# Altium project PCB_Soldeerstation.PrjPcb
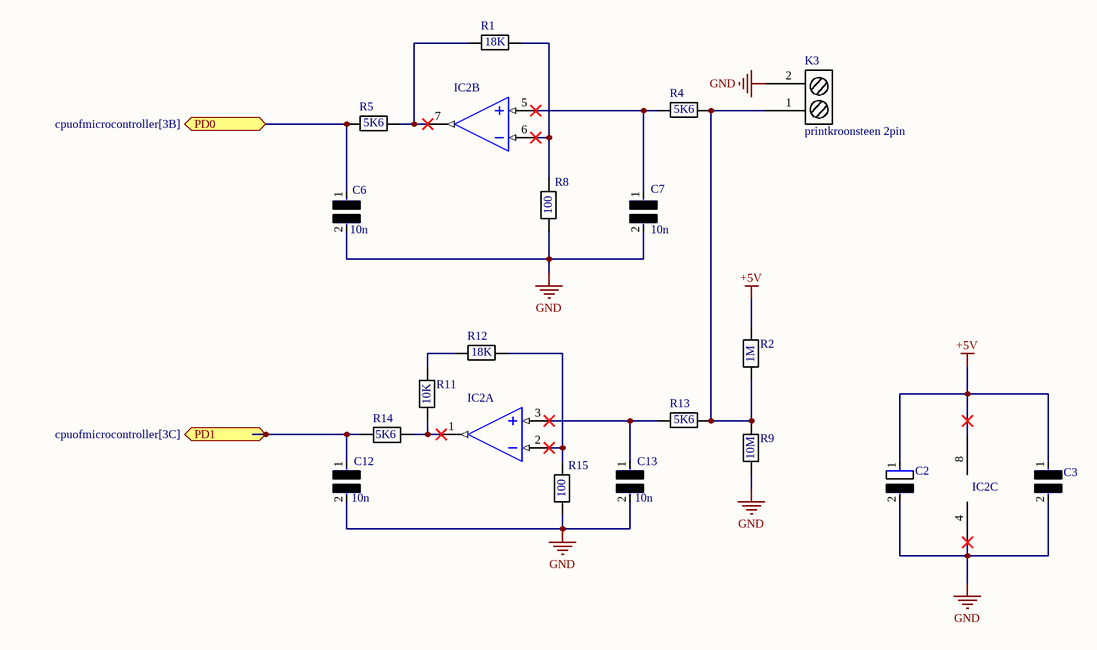
[diagram p0: soldeerboutaansturing.SchDoc]
5 sheets, 76 parts. Net scope: flat (ports and power ports of the same name join across sheets).
Board files: JVersiePCBSoldeerstation.PcbDoc, PCBbeeldscherm.PcbDoc
Sheets:
  soldeerboutaansturing.SchDoc
  thermokoppel.SchDoc
  display.SchDoc
  cpuofmicrocontroller.SchDoc
  voeding.SchDoc

## Sheet soldeerboutaansturing.SchDoc
size A4; SheetNumber: 1; SheetTotal: 5

### Parts
C2  (no value)  [RESC2013X50X30LL20T20]
C3  (no value)  [RESC2013X50X30LL20T20]
C6  10n  [RESC2013X50X30LL20T20]
C7  10n  [RESC2013X50X30LL20T20]
C12  10n  [RESC2013X50X30LL20T20]
C13  10n  [RESC2013X50X30LL20T20]
IC2  OPAMP  [DIP781W56P254L950H533Q8N]  (value not drawn)  (parts A,B,C of 3)
K3  printkroonsteen 2pin  [printkroonsteen 2pin]
R1  18K  [RESC2013X50X30LL20T20]
R2  1M  [RESC2013X50X30LL20T20]
R4  5K6  [RESC2013X50X30LL20T20]
R5  5K6  [RESC2013X50X30LL20T20]
R8  100  [RESC2013X50X30LL20T20]
R9  10M  [RESC2013X50X30LL20T20]
R11  10K  [RESC2013X50X30LL20T20]
R12  18K  [RESC2013X50X30LL20T20]
R13  5K6  [RESC2013X50X30LL20T20]
R14  5K6  [RESC2013X50X30LL20T20]
R15  100  [RESC2013X50X30LL20T20]

### Ports
PD0 (bidir, see cpuofmicrocontroller[3B]), PD1 (bidir, see cpuofmicrocontroller[3C])

### Nets
+5V: C2.1 C3.1 IC2.8 R2.2
GND: C2.2 C3.2 C6.2 C7.2 C12.2 C13.2 IC2.4 K3.2 R8.1 R9.1 R15.1
NetC6_1: C6.1 R5.1 ; port PD0
NetC7_1: C7.1 IC2.5(VINB+) R4.1
NetC12_1: C12.1 R14.2 ; port PD1
NetC13_1: C13.1 IC2.3(VINA+) R13.1
NetIC2_1: IC2.1(VOUTA) R11.1 R14.1
NetIC2_2: IC2.2(VINA-) R12.2 R15.2
NetIC2_6: IC2.6(VINB-) R1.2 R8.2
NetIC2_7: IC2.7(VOUTB) R1.1 R5.2
NetK3_1: K3.1 R2.1 R4.2 R9.2 R13.2
NetR11_2: R11.2 R12.1

### Library data of the parts
C2 = Elektrolytische Capacitor: CAP CER 0.1UF 10V X5R 0402; Manufacturer: Kemet; Manufacturer Part Number: C0402C104K8PACTU; Material: Ceramic; Capacitance: 0.10 μF; Temperature Coefficient: 15%; Tolerance: 0.1; Value: 0.10 μF; Package: C0402-BB; Temperature: -55°C to +125°C; ComponentLink2Description: Datasheet; Temperature Characteristic: X5R; Device Class L1: Passive Components; Height: 0.55mm; Lead Free: Yes; ComponentLink2URL: https://content.kemet.com/datasheets/KEM_C1002_X7R_SMD.pdf; Device Class L2: Capacitors; Temperature Range Low: -55°C; Temperature Range High: +125°C; RoHS: TRUE; Octopart: https://octopart.com/c0402c104k8pactu-kemet-140039; Automotive: No; Mouser Description: Capacitor 100 nF 10 VDC 0402 | KEMET C0402C104K8PACTU (Capacitor 100 nF 10 VDC 0402 Ceramic Capacitors).; Category: Cap; Voltage Rating: 10 V; Digikey Description: CAP CER 0.1UF 10V X5R 0402; Ipc Land Pattern Name: CAPC10050X50; Device Class L3: Ceramic Capacitors
C3 = Ceramische Capacitor
C6 C7 C12 C13 = capacitor2
IC2 = OPAMP: CMP-0187-00133-3; Slew Rate: 0.6V/µs; Supply Current: 100uA; Power Supply Rejection Ratio (PSRR): 86dB; Input Offset Voltage (Vos): 4.5mV; Input Bias Current: 1pA; Amplifier Type: GENERAL PURPOSE; Unity Gain Bandwidth Product: 1MHz; Number of Circuits: 2; Output Current: 23mA; Operating Supply Voltage: 5.5V; Min Supply Voltage: 1.8V; Common Mode Rejection Ratio: 60dB; Voltage Gain: 112dB; Max Supply Voltage: 6V; Package Quantity: 60; REACH SVHC: No SVHC; Min Operating Temperature: -40°C; Max Operating Temperature: 125°C; Mount: Through Hole; Nominal Supply Current: 100uA; Height: 3.3mm; Length: 9.27mm; Slew Rate-Nom: 0.6V/µs; Packaging: Rail/Tube; Output Current per Channel: 23mA; Number of Amplifiers: 2; RoHS Compliant: Yes; Radiation Hardening: No; Bandwidth: 1MHz; Lead Free: Lead Free; Width: 6.35mm; Number of Channels: 2; Gain Bandwidth Product: 1MHz; Technology: CMOS; Operating Supply Current: 100uA; Number of Elements: 2; Number of Pins: 8; Input Offset Voltage-Max: 4.5mV; Case/Package: PDIP
R1 R2 R4 R5 R8 R9 R11-R15 = weerstand: Manufacturer: Vishay Dale; Part Number: CRCW08050000Z0EA

## Sheet thermokoppel.SchDoc
size A4; SheetNumber: 2; SheetTotal: 5
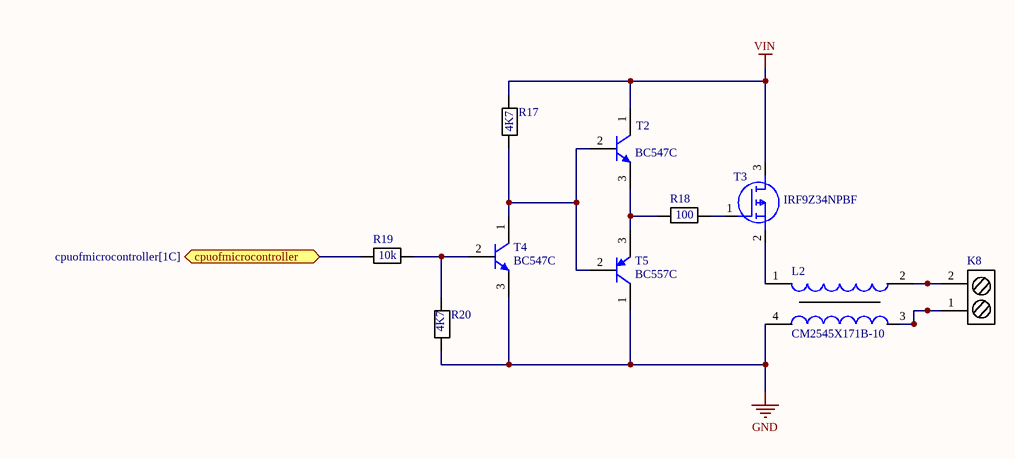
[diagram p1: thermokoppel.SchDoc]

### Parts
K8  (no value)  [printkroonsteen 2pin]
L2  CM2545X171B-10  [CM2545X171B10]
R17  4K7  [RESC2013X50X30LL20T20]
R18  100  [RESC2013X50X30LL20T20]
R19  10k  [RESC2013X50X30LL20T20]
R20  4K7  [RESC2013X50X30LL20T20]
T2  BC547C  [ONSC-TO-92-3-29-11]
T3  IRF9Z34NPBF  [TO254P469X1042X1967-3P]
T4  BC547C  [ONSC-TO-92-3-29-11]
T5  BC557C  [ONSC-TO-92-3-29-11]

### Ports
cpuofmicrocontroller (bidir, see cpuofmicrocontroller[1C])

### Nets
GND: L2.4 R20.2 T4.3(E) T5.1(C)
VIN: R17.1 T2.1(C) T3.3(D)
NetIC_1: R19.1 ; port cpuofmicrocontroller
NetK8_1: K8.1 L2.3
NetK8_2: K8.2 L2.2
NetL2_1: L2.1 T3.2(S)
NetR17_2: R17.2 T2.2(B) T4.1(C) T5.2(B)
NetR18_1: R18.1 T2.3(E) T5.3(E)
NetR18_2: R18.2 T3.1(G)
NetR19_2: R19.2 R20.1 T4.2(B)

### Library data of the parts
K8 = printkroonsteen 2pin
L2 = CM2545X171B-10: Transformer; Manufacturer_Name: Laird Technologies; Datasheet Link: https://datasheet.datasheetarchive.com/originals/dk/DKDS-7/122753.pdf; Height: 9.5mm; Manufacturer_Part_Number: CM2545X171B-10; Mouser Part Number: N/A; Mouser Price/Stock: https://www.mouser.co.uk/ProductDetail/Laird/CM2545X171B-10?qs=PzGy0jfpSMtNfkEypgU65A%3D%3D; Arrow Part Number: CM2545X171B-10; Arrow Price/Stock: https://www.arrow.com/en/products/cm2545x171b-10/laird-technologies
R17-R20 = weerstand: as R1 on sheet soldeerboutaansturing
T2 T4 = BC547C: Amplifier Transistor, NPN Silicon, 3-Pin TO-92, Bulk Box; Manufacturer: On Semiconductor; IC Continuous (A): 0.1; fT Min (MHz): 150; Mounting Technology: Through Hole; ComponentLink1URL: http://www.onsemi.com/; ComponentLink1Description: Manufacturer URL; ComponentLink3URL: http://www.onsemi.cn/pub_link/Collateral/2N6426-D.PDF; DatasheetVersion: Rev. 7; PackageVersion: Rev. AM; Packing: Bulk Box; RoHS: FALSE; Polarity: NPN; PartNumber: BC547C; ComponentLink2URL: http://www.onsemi.com/pub_link/Collateral/BC546-D.PDF; ComponentLink3Description: Package Specification; PackageDescription: 3-Pin Transistor Outline, Body 4.825 x 3.685 mm, Pitch 1.27 mm; PackageReference: TO-92-3-29-11_AM_SL; ComponentLink2Description: Datasheet
T3 = IRF9Z34NPBF: MOSFET (P-Channel); Manufacturer_Name: Infineon; Datasheet Link: https://www.infineon.com/dgdl/irf9z34npbf.pdf?fileId=5546d462533600a40153561220af1ddd; Height: 4.69mm; Manufacturer_Part_Number: IRF9Z34NPBF; Mouser Part Number: 942-IRF9Z34NPBF; Mouser Price/Stock: https://www.mouser.co.uk/ProductDetail/Infineon-Technologies/IRF9Z34NPBF?qs=9%252BKlkBgLFf16a%2FvlD%252BMCtQ%3D%3D; Arrow Part Number: IRF9Z34NPBF; Arrow Price/Stock: https://www.arrow.com/en/products/irf9z34npbf/infineon-technologies-ag?region=nac
T5 = BC557C: Amplifier Transistor, PNP Silicon, 3-Pin TO-92, Bulk Box; Manufacturer: On Semiconductor; IC Continuous (A): -0.1; Polarity: PNP; PartNumber: BC557C; PackageVersion: Rev. AM; RoHS: FALSE; PackageDescription: 3-Pin Transistor Outline, Body 4.825 x 3.685 mm, Pitch 1.27 mm; Packing: Bulk Box; ComponentLink2Description: Datasheet; DatasheetVersion: Rev. 3; ComponentLink3Description: Package Specification; Mounting Technology: Through Hole; ComponentLink2URL: http://www.onsemi.com/pub_link/Collateral/BC556B-D.PDF; ComponentLink1URL: http://www.onsemi.com/; ComponentLink1Description: Manufacturer URL; ComponentLink3URL: http://www.onsemi.cn/pub_link/Collateral/2N6426-D.PDF; PackageReference: TO-92-3-29-11_AM_SL

## Sheet display.SchDoc
size A4; SheetNumber: 3; SheetTotal: 5
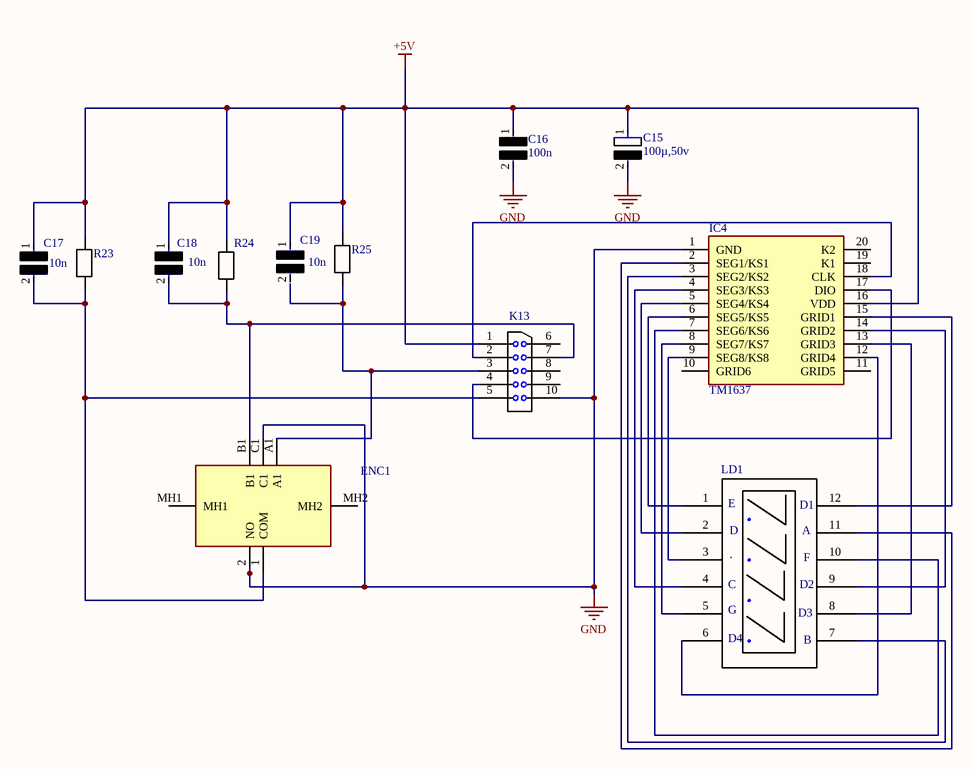
[diagram p2: display.SchDoc]

### Parts
C15  100µ,50v  [RESC2013X50X30LL20T20]
C16  100n  [RESC2013X50X30LL20T20]
C17  10n  [RESC2013X50X30LL20T20]
C18  10n  [RESC2013X50X30LL20T20]
C19  10n  [RESC2013X50X30LL20T20]
ENC1  Switch  [482009514001]  (value not drawn)
IC4  TM1637  [DIP778W53P254L2612H431Q20N]
K13  Pinheader,2rijig,10-polig  [PINHEADER, 2RIJIG,10-POLIG - duplicate - duplicate - duplicate]  (value not drawn)
LD1  7segdisplay  [7SEGDISPALY]  (value not drawn)
R23  weerstand  [RESC2013X50X30LL20T20]  (value not drawn)
R24  weerstand  [RESC2013X50X30LL20T20]  (value not drawn)
R25  weerstand  [RESC2013X50X30LL20T20]  (value not drawn)

### Nets
+5V: C15.1 C16.1 C17.1 C18.1 C19.1 IC4.16(VDD) K13.1 R23.2 R24.2 R25.2
GND: C15.2 C16.2 ENC1.2(NO) ENC1.C1 IC4.1(GND) K13.10
NetC17_2: C17.2 ENC1.1(COM) K13.5 R23.1
NetC18_2: C18.2 ENC1.B1 K13.7 R24.1
NetENC1_A1: ENC1.A1 K13.3 R25.1
NetIC4_2: IC4.2(SEG1/KS1) LD1.11
NetIC4_3: IC4.3(SEG2/KS2) LD1.7
NetIC4_4: IC4.4(SEG3/KS3) LD1.4
NetIC4_5: IC4.5(SEG4/KS4) LD1.2
NetIC4_6: IC4.6(SEG5/KS5) LD1.1
NetIC4_7: IC4.7(SEG6/KS6) LD1.10
NetIC4_8: IC4.8(SEG7/KS7) LD1.5
NetIC4_9: IC4.9(SEG8/KS8) LD1.3
NetIC4_12: IC4.12(GRID4) LD1.6
NetIC4_13: IC4.13(GRID3) LD1.8
NetIC4_14: IC4.14(GRID2) LD1.9
NetIC4_15: IC4.15(GRID1) LD1.12
NetIC4_17: IC4.17(DIO) K13.4
NetIC4_18: IC4.18(CLK) K13.2

Not connected (* = marked no-connect by the designer): C19 2; ENC1 MH1 MH2; IC4 10(GRID6) 11(GRID5) 19(K1) 20(K2); K13 6 8 9

### Notes on the sheet
- (in symbol 7segdisplay) E; D1; D; A; .; F; C; D2; G; D3; D4; B

### Library data of the parts
C15 = Elektrolytische Capacitor: as C2 on sheet soldeerboutaansturing; Package: C0402-BB; Temperature: -55°C to +125°C; ComponentLink2Description: Datasheet; Temperature Characteristic: X5R; Device Class L1: Passive Components; Height: 0.55mm; Lead Free: Yes; ComponentLink2URL: https://content.kemet.com/datasheets/KEM_C1002_X7R_SMD.pdf; Device Class L2: Capacitors; Temperature Range Low: -55°C; Temperature Range High: +125°C; RoHS: TRUE; Octopart: https://octopart.com/c0402c104k8pactu-kemet-140039; Automotive: No; Mouser Description: Capacitor 100 nF 10 VDC 0402 | KEMET C0402C104K8PACTU (Capacitor 100 nF 10 VDC 0402 Ceramic Capacitors).; Category: Cap; Voltage Rating: 10 V; Digikey Description: CAP CER 0.1UF 10V X5R 0402; Ipc Land Pattern Name: CAPC10050X50; Device Class L3: Ceramic Capacitors
C16-C19 = Ceramische Capacitor
ENC1 = Switch: Manufacturer_Name: Wurth Elektronik; Height: 26.6mm; Manufacturer_Part_Number: 482009514001; Mouser Part Number: 710-482009514001; Mouser Price/Stock: https://www.mouser.co.uk/ProductDetail/Wurth-Elektronik/482009514001?qs=2WXlatMagcFsR1YvhlUIOw%3D%3D
IC4 = TM1637: Integrated Circuit; Manufacturer_Name: TITAN MICRO ELECTRONICS; Height: 4.31mm; Manufacturer_Part_Number: TM1637
R23-R25 = weerstand: as R1 on sheet soldeerboutaansturing

## Sheet cpuofmicrocontroller.SchDoc
size A4; SheetNumber: 4; SheetTotal: 5
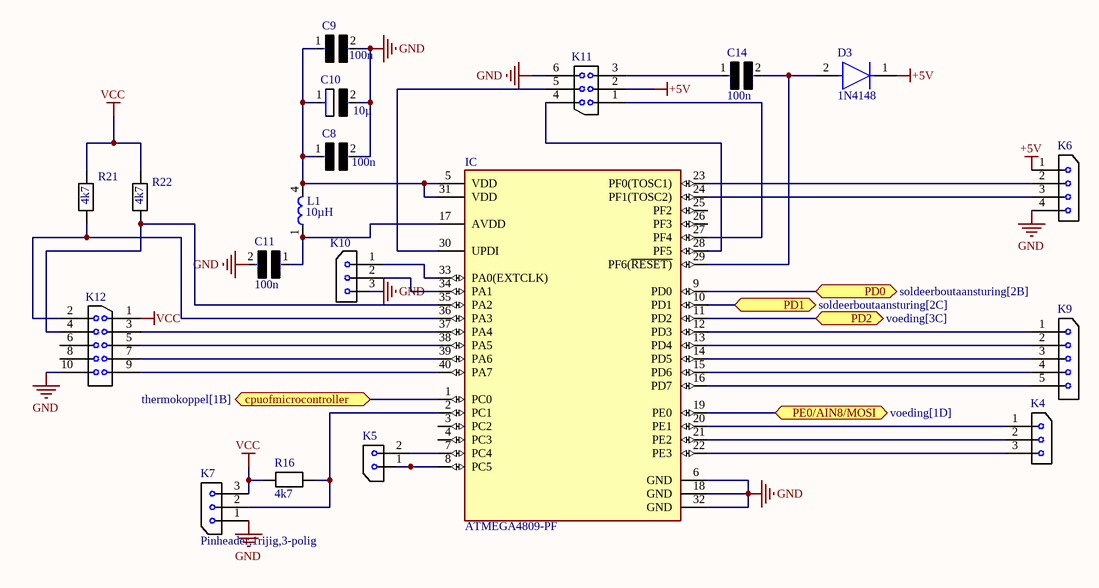
[diagram p3: cpuofmicrocontroller.SchDoc]

### Parts
C8  100n  [RESC2013X50X30LL20T20]
C9  100n  [RESC2013X50X30LL20T20]
C10  10µ  [RESC2013X50X30LL20T20]
C11  100n  [RESC2013X50X30LL20T20]
C14  100n  [RESC2013X50X30LL20T20]
D3  1N4148  [FP-017AG-MFG]
IC  ATMEGA4809-PF  [FP-C04-016-MFG]
K4  (no value)  [PINHEADER, 1RIJIG,3-POLIG]
K5  (no value)  [Pinheader,1rijig,2-polig]
K6  (no value)  [PINHEADER, 1RIJIG,4-POLIG - duplicate]
K7  Pinheader,1rijig,3-polig  [PINHEADER, 1RIJIG,3-POLIG]
K9  (no value)  [HDRV5W67P0X254_1X5_1270X241X858P]
K10  (no value)  [PINHEADER, 1RIJIG,3-POLIG]
K11  (no value)  [PINHEADER, 1RIJIG,6-POLIG - duplicate - duplicate]
K12  Pinheader,2rijig,10-polig  [PINHEADER, 2RIJIG,10-POLIG - duplicate - duplicate - duplicate]  (value not drawn)
L1  10µH  [Laird CM2545x171B-10]
R16  4k7  [RESC2013X50X30LL20T20]
R21  4k7  [RESC2013X50X30LL20T20]
R22  4k7  [RESC2013X50X30LL20T20]

### Ports
cpuofmicrocontroller (bidir, see thermokoppel[1B]), PD0 (bidir, see soldeerboutaansturing[2B]), PD1 (bidir, see soldeerboutaansturing[2C]), PD2 (bidir, see voeding[3C]), PE0/AIN8/MOSI (bidir, see voeding[1D])

### Nets
+5V: D3.1(C) K6.1 K11.2
GND: C8.2 C9.2 C10.2 C11.2 IC.6(GND) IC.18(GND) IC.32(GND) K6.4 K7.1 K10.3 K11.6 K12.10
VCC: K7.3 K12.1 R16.1 R21.2 R22.2
NetC6_1: IC.9(PD0) ; port PD0
NetC8_1: C8.1 C9.1 C10.1 IC.5(VDD) IC.31(VDD) L1.4
NetC11_1: C11.1 IC.17(AVDD) L1.1
NetC12_1: IC.10(PD1) ; port PD1
NetC14_1: C14.1 K11.3
NetC14_2: C14.2 D3.2(A) IC.29(PF6(~{RESET)})
NetD2_1: IC.11(PD2) ; port PD2
NetIC_1: IC.1(PC0) ; port cpuofmicrocontroller
NetIC_2: IC.2(PC1) K7.2 R16.2
NetIC_7: IC.7(PC4) K5.2
NetIC_8: IC.8(PC5) K5.1
NetIC_12: IC.12(PD3) K9.1
NetIC_13: IC.13(PD4) K9.2
NetIC_14: IC.14(PD5) K9.3
NetIC_15: IC.15(PD6) K9.4
NetIC_16: IC.16(PD7) K9.5
NetIC_19: IC.19(PE0) ; port PE0/AIN8/MOSI
NetIC_20: IC.20(PE1) K4.1
NetIC_21: IC.21(PE2) K4.2
NetIC_22: IC.22(PE3) K4.3
NetIC_23: IC.23(PF0(TOSC1)) K6.2
NetIC_24: IC.24(PF1(TOSC2)) K6.3
NetIC_27: IC.27(PF4) K11.1
NetIC_28: IC.28(PF5) K11.4
NetIC_30: IC.30(UPDI) K11.5
NetIC_33: IC.33(PA0(EXTCLK)) K10.1
NetIC_34: IC.34(PA1) K10.2
NetIC_35: IC.35(PA2) K12.4 R22.1
NetIC_36: IC.36(PA3) K12.2 R21.1
NetIC_37: IC.37(PA4) K12.3
NetIC_38: IC.38(PA5) K12.5
NetIC_39: IC.39(PA6) K12.7
NetIC_40: IC.40(PA7) K12.9

Not connected (* = marked no-connect by the designer): IC 3(PC2) 4(PC3) 25(PF2) 26(PF3); K12 6 8

### Library data of the parts
C8 C9 C11 = capacitor2
C10 = Capacitor: CAP CER 0.1UF 10V X5R 0402; Manufacturer: Kemet; Manufacturer Part Number: C0402C104K8PACTU; Material: Ceramic; Capacitance: 0.10 μF; Temperature Coefficient: 15%; Tolerance: 0.1; Value: 0.10 μF; Package: C0402-BB; Temperature: -55°C to +125°C; ComponentLink2Description: Datasheet; Temperature Characteristic: X5R; Device Class L1: Passive Components; Height: 0.55mm; Lead Free: Yes; ComponentLink2URL: https://content.kemet.com/datasheets/KEM_C1002_X7R_SMD.pdf; Device Class L2: Capacitors; Temperature Range Low: -55°C; Temperature Range High: +125°C; RoHS: TRUE; Octopart: https://octopart.com/c0402c104k8pactu-kemet-140039; Automotive: No; Mouser Description: Capacitor 100 nF 10 VDC 0402 | KEMET C0402C104K8PACTU (Capacitor 100 nF 10 VDC 0402 Ceramic Capacitors).; Category: Cap; Voltage Rating: 10 V; Digikey Description: CAP CER 0.1UF 10V X5R 0402; Ipc Land Pattern Name: CAPC10050X50; Device Class L3: Ceramic Capacitors
C14 = Ceramische Capacitor
D3 = 1N4148: DIODE GEN PURP 100V 200MA DO35/1N4148; Forward Voltage: 1V; Max Power Dissipation: 500mW; Max Reverse Current: 5uA; Forward Current: 300mA; Current: 4A; Reverse Recovery Time: 4ns; Element Configuration: Single; Outside Diameter: 1.85mm; Capacitance: 4pF; Polarity: Standard; Max Forward Surge Current (Ifsm): 1A; Reverse Voltage: 100V; Output Current: 200mA; Average Rectified Current: 200mA; Diameter: 1.91mm; Max Repetitive Reverse Voltage (Vrrm): 100V; Current Rating: 200mA; Case/Package: DO-35; Lead Free: Lead Free; Number of Pins: 2; Recovery Time: 4ns; Packaging: Bulk; Contact Plating: Tin; Voltage: 100V; Mount: Through Hole; Max Surge Current: 4A; Package Quantity: 2000; Width: 1.91mm; Max Reverse Voltage (DC): 100V; Length: 4.56mm; Radiation Hardening: No; Power Dissipation: 500mW; Voltage Rating (DC): 100V; Peak Non-Repetitive Surge Current: 4A; REACH SVHC: No SVHC; Height: 4.56mm; Max Operating Temperature: 175°C; Series: -; Weight: 0.01lb; Min Operating Temperature: -65°C
IC = aTmega4809-PF: IC MCU 8BIT 48KB FLASH 40DIP; RoHS Compliant: Yes
K4 K10 = Pinheader,1rijig,3-polig
K5 = Pinheader,1rijig,2-polig
K6 = Pinheader,1rijig,4-polig
K9 = 5PIN HEADERmale: Connector; Manufacturer_Name: Amphenol Communications Solutions; Manufacturer_Part_Number: 68000-105HTLF; Datasheet Link: https://cdn.amphenol-cs.com/media/wysiwyg/files/drawing/68000.pdf; Height: 8.58mm; Mouser Part Number: 649-68000-105HTLF; Mouser Price/Stock: https://www.mouser.co.uk/ProductDetail/Amphenol-FCI/68000-105HTLF?qs=w%2Fv1CP2dgqrYgNyQVoiqDw%3D%3D; Arrow Part Number: 68000-105HTLF; Arrow Price/Stock: https://www.arrow.com/en/products/68000-105htlf/amphenol-fci
K11 = Pinheader,2rijig,6-polig
L1 = spoelL1
R16 R21 R22 = weerstand: as R1 on sheet soldeerboutaansturing

## Sheet voeding.SchDoc
size A4; SheetNumber: 5; SheetTotal: 5
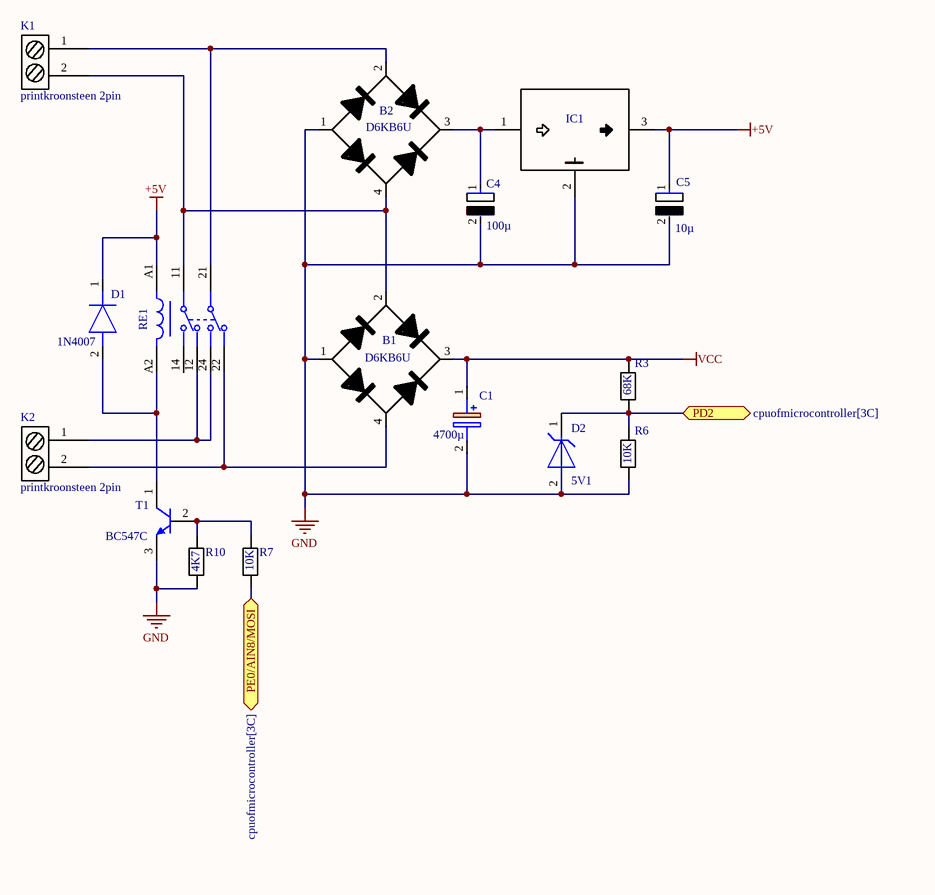
[diagram p4: voeding.SchDoc]

### Parts
B1  D6KB6U  [D6KB6U]
B2  D6KB6U  [D6KB6U]
C1  4700µ  [CAPPRD1000W80D2200H3700]
C4  100µ  [100uF/50v aluminum electrolytic capacitor]
C5  10µ  [RESC2013X50X30LL20T20]
D1  1N4007  [DIOAD1405W86L465D235]
D2  5V1  [FP-SOD123-IPC_A]
IC1  (no value)  [MURA-OKI-78SR-3]
K1  printkroonsteen 2pin  [printkroonsteen 2pin]
K2  printkroonsteen 2pin  [printkroonsteen 2pin]
R3  68K  [RESC2013X50X30LL20T20]
R6  10K  [RESC2013X50X30LL20T20]
R7  10K  [RESC2013X50X30LL20T20]
R10  4K7  [RESC2013X50X30LL20T20]
RE1  (no value)  [FP-RT424005-MFG]
T1  BC547C  [ONSC-TO-92-3-29-11]

### Ports
PD2 (bidir, see cpuofmicrocontroller[3C]), PE0/AIN8/MOSI (bidir, see cpuofmicrocontroller[3C])

### Nets
+5V: C5.1 D1.1(K) IC1.3 RE1.A1
GND: B1.1 B2.1 C1.2(-) C4.2 C5.2 D2.2(A) IC1.2(COMMON) R6.1 R10.1 T1.3(E)
VCC: B1.3 C1.1(+) R3.2
NetB1_2: B1.2 B2.4 K1.2 RE1.11
NetB1_4: B1.4 K2.2 RE1.22
NetB2_2: B2.2 K1.1 RE1.21
NetB2_3: B2.3 C4.1 IC1.1
NetD1_2: D1.2(A) RE1.A2 T1.1(C)
NetD2_1: D2.1(C) R3.1 R6.2 ; port PD2
NetIC_19: R7.1 ; port PE0/AIN8/MOSI
NetK2_1: K2.1 RE1.12 RE1.24
NetR7_2: R7.2 R10.2 T1.2(B)

Not connected (* = marked no-connect by the designer): RE1 14

### Library data of the parts
C1 = CondensatorGroot: Capacitor Polarised; Manufacturer_Name: KEMET; Manufacturer_Part_Number: ESK478M050AQ3AA; Datasheet Link: https://content.kemet.com/datasheets/KEM_A4004_ESK.pdf; Height: 37mm; Mouser Part Number: 80-ESK478M050AQ3AA; Mouser Price/Stock: https://www.mouser.co.uk/ProductDetail/KEMET/ESK478M050AQ3AA?qs=gt1LBUVyoHl7SM9dsUCJjA%3D%3D
C4 C5 = Capacitor: as C10 on sheet cpuofmicrocontroller; Package: C0402-BB; Temperature: -55°C to +125°C; ComponentLink2Description: Datasheet; Temperature Characteristic: X5R; Device Class L1: Passive Components; Height: 0.55mm; Lead Free: Yes; ComponentLink2URL: https://content.kemet.com/datasheets/KEM_C1002_X7R_SMD.pdf; Device Class L2: Capacitors; Temperature Range Low: -55°C; Temperature Range High: +125°C; RoHS: TRUE; Octopart: https://octopart.com/c0402c104k8pactu-kemet-140039; Automotive: No; Mouser Description: Capacitor 100 nF 10 VDC 0402 | KEMET C0402C104K8PACTU (Capacitor 100 nF 10 VDC 0402 Ceramic Capacitors).; Category: Cap; Voltage Rating: 10 V; Digikey Description: CAP CER 0.1UF 10V X5R 0402; Ipc Land Pattern Name: CAPC10050X50; Device Class L3: Ceramic Capacitors
D1 = 1N4007-E3_73: Diode; Manufacturer_Name: Vishay; Manufacturer_Part_Number: 1N4007-E3/73; Datasheet Link: https://mouser.componentsearchengine.com/Datasheets/2/1N4007-E3_73.pdf; Mouser Part Number: 625-1N4007-E3/73; Mouser Price/Stock: https://www.mouser.co.uk/ProductDetail/Vishay-General-Semiconductor/1N4007-E3-73?qs=N4vtoAxH%2FSqT3Ng3e4K0Gw%3D%3D; Arrow Part Number: 1N4007-E3/73; Arrow Price/Stock: https://www.arrow.com/en/products/1n4007-e373/vishay?region=europe
D2 = Zenerdiode: DIODE ZENER 5.1V 500MW SOD123; Manufacturer Part Number: BZT52C5V1-7-F; Manufacturer: Diodes Incorporated; Standoff Height: 0mm; Max Reverse Leakage Current: 2uA; Forward Current: 10mA; Power Dissipation: 370mW; Max Zener Voltage: 5.4V; Zener Impedance: 60Ω; Automotive Grade: NA; Max Junction Temp: +150°C; Device Class L3: Zener Diodes; ComponentLink2Description: Datasheet; Mouser Description: Zener Diodes 5.1V 500mW; Octopart: https://octopart.com/bzt52c5v1-7-f-diodes+inc.-326718; Package: SOD123; RoHS: TRUE; Nom Zener Voltage: 5.1V; Device Class L1: Discrete Semiconductors; Lead Free: Yes; Footprint Url: https://www.diodes.com/assets/Package-Files/SOD123.pdf; ComponentLink2URL: https://www.diodes.com/assets/Datasheets/ds18004.pdf; Digikey Description: DIODE ZENER 5.1V 500MW SOD123; Height: 1.45mm; Temperature Range Low: -65°C; Device Class L2: Diodes; Temperature: -65°C to +150°C; Automotive: No; Temperature Range High: +150°C; Category: Diode
IC1 = OKI-78SR-5/1.5-W36-C: Non-Isolated DC/DC Converter, 7.5 W, 7 to 36 V, 1.5 A, -40 to 85 degC, 3-Pin THD, RoHS; Manufacturer: Murata; Current - Output (Max): 1.5A; Power (Watts) - Max: 8W; Efficiency: 90.5%; Voltage - Input (Min): 7V; Voltage - Input (Max): 36V; Voltage - Output 1: 5V; Number of Outputs: 1; Package / Case: 3-SIPModule; Features: SCP; Type: LinearRegulatorReplacement; Size / Dimension: 0.41"Lx0.30"Wx0.65"H(10.4mmx7.6mmx16.5mm); Datasheet URL: https://datasheet.ciiva.com/8006/1790439-8006672.pdf; Datasheet Version: Oct-13; Power (Watts) - Manufacture Series: 8W; Voltage - Output 2: -; Series: Okami™OKI-78SR; Family: DCDCConverters; Manufacturer URL: http://www.murata.com/; Category: PowerSupplies-BoardMount; Voltage - Isolation: -; Packaging: Tube; Applications: ITE(Commercial); Mounting Type: ThroughHole; Voltage - Output 3: -; Operating Temperature: -40degC~85degC
R3 R6 R7 R10 = weerstand: as R1 on sheet soldeerboutaansturing
RE1 = RT424005: RELAY GENERAL PURPOSE DPDT 8A 5V; Manufacturer: TE Connectivity; Coil Power: 403mW; Number Of Contacts: 2; Coil Resistance: 62Ω; Coil Type: Non-Latching; Manufacturer Part Number: RT424005; Category: Relay; Octopart: https://octopart.com/5-1393243-9-te+connectivity-41835766; Device Class L3: Power Relays; ComponentLink2URL: https://www.te.com/commerce/DocumentDelivery/DDEController?Action=showdoc&DocId=Data+Sheet%7FRT2%7F1014%7Fpdf%7FEnglish%7FENG_DS_RT2_1014.pdf%7F5-1393243-9; Ambient Temperature Range High: +85°C; ComponentLink2Description: Datasheet; Throw Configuration: DPDT; Digikey Description: RELAY GENERAL PURPOSE DPDT 8A 5V; Package: RT424005; Automotive: No; Device Class L1: Electromechanical; Height: 15.7mm; Device Class L2: Relays; Ambient Temperature Range Low: -40°C; Coil Voltage: 5V; Current Rating: 8A; Mouser Description: General Purpose Relay, Rt2 Series, Power, Non Latching, Dpdt, 5 Vdc, 8 A Rohs Compliant: Yes; Lead Free: Yes; RoHS: TRUE
T1 = BC547C: as T2 on sheet thermokoppel; Mounting Technology: Through Hole; ComponentLink1URL: http://www.onsemi.com/; ComponentLink1Description: Manufacturer URL; ComponentLink3URL: http://www.onsemi.cn/pub_link/Collateral/2N6426-D.PDF; DatasheetVersion: Rev. 7; PackageVersion: Rev. AM; Packing: Bulk Box; RoHS: FALSE; Polarity: NPN; PartNumber: BC547C; ComponentLink2URL: http://www.onsemi.com/pub_link/Collateral/BC546-D.PDF; ComponentLink3Description: Package Specification; PackageDescription: 3-Pin Transistor Outline, Body 4.825 x 3.685 mm, Pitch 1.27 mm; PackageReference: TO-92-3-29-11_AM_SL; ComponentLink2Description: Datasheet

## Nets that join several sheets
+5V: soldeerboutaansturing (C2.1 C3.1 IC2.8 R2.2), display (10 pins), cpuofmicrocontroller (D3.1 K6.1 K11.2), voeding (C5.1 D1.1 IC1.3 RE1.A1)
GND: soldeerboutaansturing (11 pins), thermokoppel (L2.4 R20.2 T4.3 T5.1), display (6 pins), cpuofmicrocontroller (12 pins), voeding (10 pins)
VCC: cpuofmicrocontroller (5 pins), voeding (B1.3 C1.1 R3.2)
NetC6_1: soldeerboutaansturing (C6.1 R5.1), cpuofmicrocontroller (IC.9)
NetC12_1: soldeerboutaansturing (C12.1 R14.2), cpuofmicrocontroller (IC.10)
NetD2_1: cpuofmicrocontroller (IC.11), voeding (D2.1 R3.1 R6.2)
NetIC_1: thermokoppel (R19.1), cpuofmicrocontroller (IC.1)
NetIC_19: cpuofmicrocontroller (IC.19), voeding (R7.1)